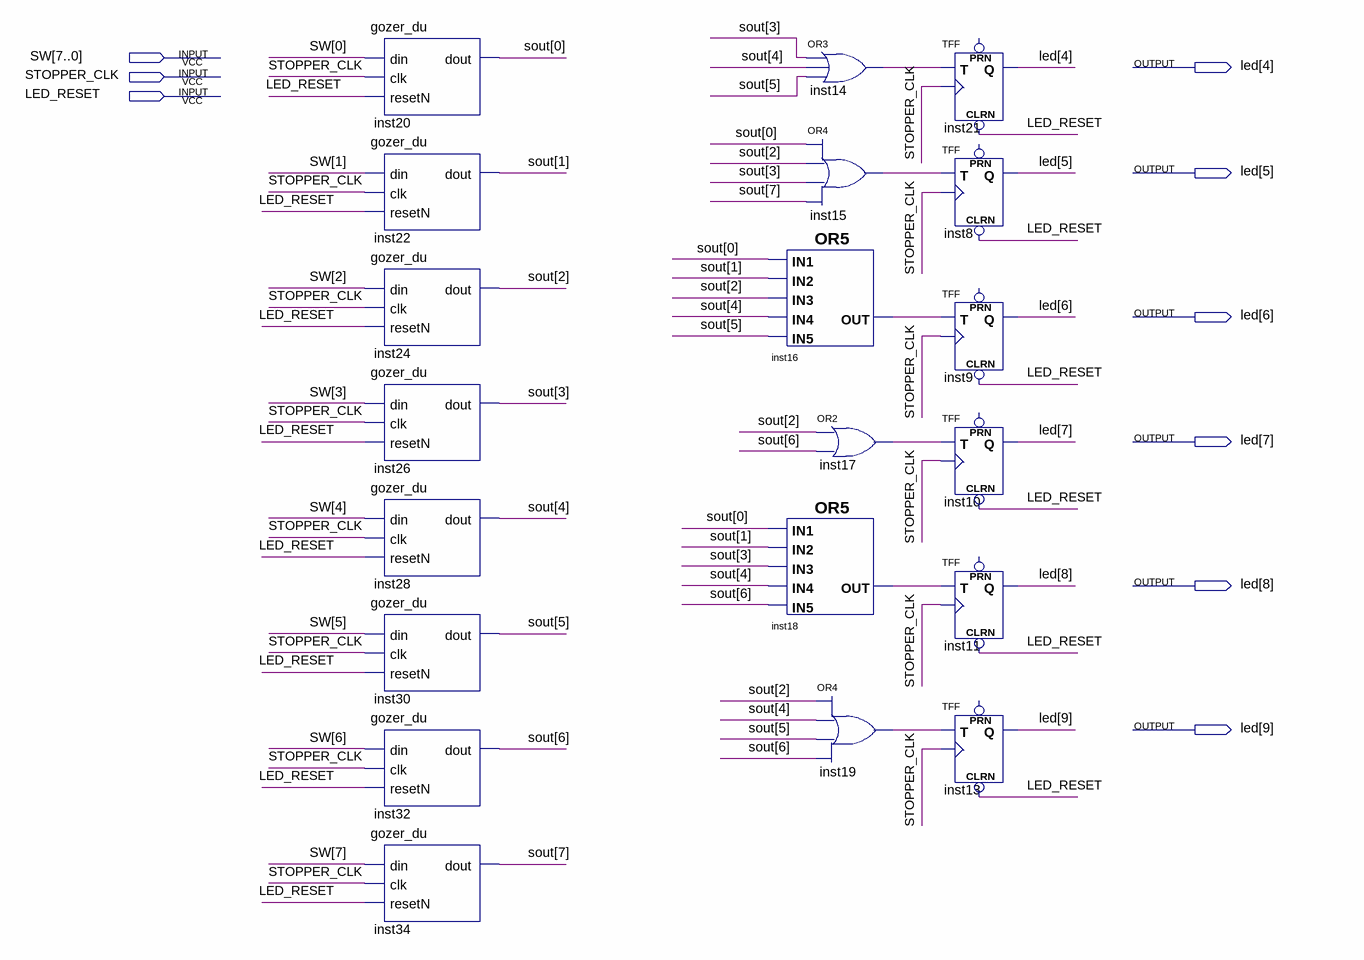
[diagram p0: schematic sheet]
// Quartus schematic LEDs.bdf as structural Verilog: 20 symbols, 9 pins
module LEDs (
  input  [7:0] SW,
  input  STOPPER_CLK,
  input  LED_RESET,
  output [9:4] led
);

  wire inst14_out, inst15_out, inst16_out, inst17_out, inst18_out, inst19_out;
  wire [7:0] sout;

  gozer_du inst20 (.din(SW[0]), .clk(STOPPER_CLK), .resetN(LED_RESET), .dout(sout[0]));
  gozer_du inst22 (.din(SW[1]), .clk(STOPPER_CLK), .resetN(LED_RESET), .dout(sout[1]));
  gozer_du inst24 (.din(SW[2]), .clk(STOPPER_CLK), .resetN(LED_RESET), .dout(sout[2]));
  gozer_du inst26 (.din(SW[3]), .clk(STOPPER_CLK), .resetN(LED_RESET), .dout(sout[3]));
  gozer_du inst28 (.din(SW[4]), .clk(STOPPER_CLK), .resetN(LED_RESET), .dout(sout[4]));
  gozer_du inst30 (.din(SW[5]), .clk(STOPPER_CLK), .resetN(LED_RESET), .dout(sout[5]));
  gozer_du inst32 (.din(SW[6]), .clk(STOPPER_CLK), .resetN(LED_RESET), .dout(sout[6]));
  gozer_du inst34 (.din(SW[7]), .clk(STOPPER_CLK), .resetN(LED_RESET), .dout(sout[7]));
  or inst14 (inst14_out, sout[3], sout[4], sout[5]);
  or inst15 (inst15_out, sout[0], sout[2], sout[3], sout[7]);
  or inst16 (inst16_out, sout[0], sout[1], sout[2], sout[4], sout[5]);
  or inst18 (inst18_out, sout[0], sout[1], sout[3], sout[4], sout[6]);
  or inst17 (inst17_out, sout[2], sout[6]);
  or inst19 (inst19_out, sout[2], sout[4], sout[5], sout[6]);
  TFF inst21 (.CLRN(LED_RESET), .T(inst14_out), .CLK(STOPPER_CLK), .Q(led[4]));  // open: PRN
  TFF inst8 (.CLRN(LED_RESET), .T(inst15_out), .CLK(STOPPER_CLK), .Q(led[5]));  // open: PRN
  TFF inst9 (.CLRN(LED_RESET), .T(inst16_out), .CLK(STOPPER_CLK), .Q(led[6]));  // open: PRN
  TFF inst10 (.CLRN(LED_RESET), .T(inst17_out), .CLK(STOPPER_CLK), .Q(led[7]));  // open: PRN
  TFF inst11 (.CLRN(LED_RESET), .T(inst18_out), .CLK(STOPPER_CLK), .Q(led[8]));  // open: PRN
  TFF inst13 (.CLRN(LED_RESET), .T(inst19_out), .CLK(STOPPER_CLK), .Q(led[9]));  // open: PRN
endmodule
